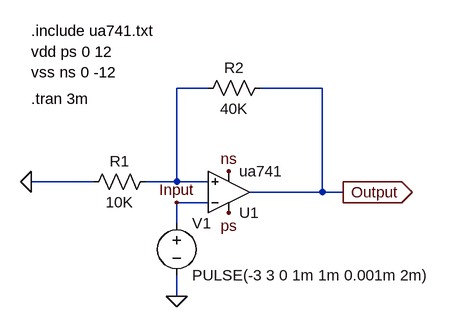
[diagram p0: schematic Schmitt Trigger.asc]
Schmitt Trigger.asc, the LTspice schematic file:
Version 4.1
SHEET 1 880 680
WIRE 224 16 176 16
WIRE 400 16 304 16
WIRE 48 160 -48 160
WIRE 176 160 176 16
WIRE 176 160 128 160
WIRE 224 160 176 160
WIRE 400 176 400 16
WIRE 400 176 288 176
WIRE 432 176 400 176
WIRE 224 192 176 192
WIRE 176 224 176 192
WIRE 176 336 176 304
FLAG -48 160 0
FLAG 176 336 0
FLAG 432 176 Output
IOPIN 432 176 Out
FLAG 256 144 ns
FLAG 256 208 ps
FLAG 176 192 Input
SYMBOL OpAmps\\opamp2 256 240 M180
SYMATTR InstName U1
SYMATTR Value ua741
SYMBOL res 144 144 R90
WINDOW 0 0 56 VBottom 2
WINDOW 3 32 56 VTop 2
SYMATTR InstName R1
SYMATTR Value 10K
SYMBOL res 320 0 R90
WINDOW 0 0 56 VBottom 2
WINDOW 3 32 56 VTop 2
SYMATTR InstName R2
SYMATTR Value 40K
SYMBOL voltage 176 208 R0
WINDOW 123 0 0 Left 0
WINDOW 39 0 0 Left 0
SYMATTR InstName V1
SYMATTR Value PULSE(-3 3 0 1m 1m 0.001m 2m)
TEXT -48 -40 Left 2 !vdd ps 0 12\nvss ns 0 -12
TEXT -48 32 Left 2 !.tran 3m
TEXT -48 -72 Left 2 !.include ua741.txt

The netlist it stands for:
* Schmitt Trigger.asc
X§U1 N001 Input ps ns Output ua741  ; pins In+ In- V+ V- OUT
R1 N001 0 10K
R2 Output N001 40K
V1 Input 0 PULSE(-3 3 0 1m 1m 0.001m 2m)
vdd ps 0 12
vss ns 0 -12
.tran 3m
.include ua741.txt
.backanno
.end